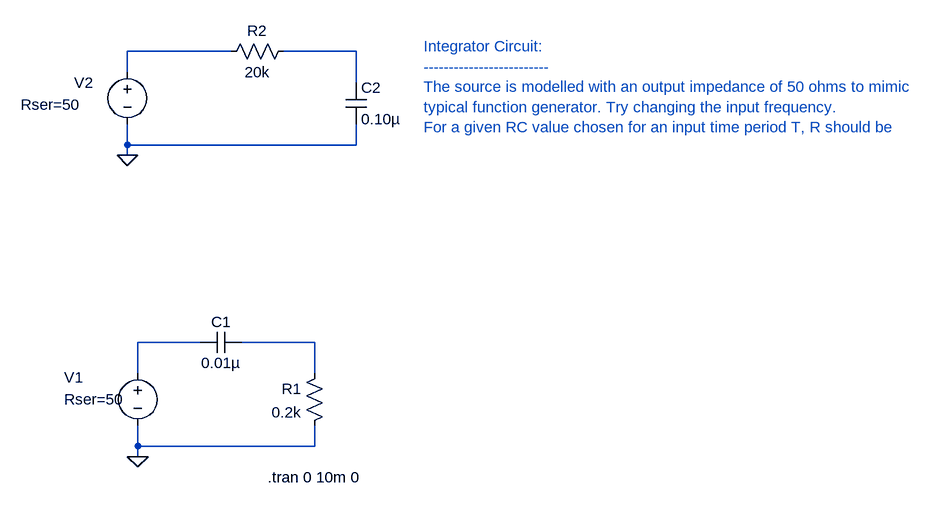
[diagram p0: schematic Demo_RC-Circuits.asc]
Demo_RC-Circuits.asc, the LTspice schematic file:
Version 4.1
SHEET 1 1540 680
WIRE -320 -320 -480 -320
WIRE -128 -320 -240 -320
WIRE -480 -288 -480 -320
WIRE -128 -272 -128 -320
WIRE -480 -176 -480 -208
WIRE -128 -176 -128 -208
WIRE -128 -176 -480 -176
WIRE -480 -160 -480 -176
WIRE -368 128 -464 128
WIRE -192 128 -304 128
WIRE -464 176 -464 128
WIRE -192 176 -192 128
WIRE -464 288 -464 256
WIRE -192 288 -192 256
WIRE -192 288 -464 288
WIRE -464 304 -464 288
FLAG -464 304 0
FLAG -480 -160 0
SYMBOL res -176 160 M0
SYMATTR InstName R1
SYMATTR Value 0.2k
SYMBOL cap -304 112 R90
WINDOW 0 0 32 VBottom 2
WINDOW 3 32 32 VTop 2
SYMATTR InstName C1
SYMATTR Value 0.01µ
SYMBOL voltage -464 160 R0
WINDOW 0 -113 22 Left 2
WINDOW 3 -163 99 Invisible 2
WINDOW 123 0 0 Left 0
WINDOW 39 -113 56 Left 2
SYMATTR InstName V1
SYMATTR Value PULSE(5 -5 0 10n 10n 0.1m 0.2m)
SYMATTR SpiceLine Rser=50
SYMBOL cap -144 -272 R0
SYMATTR InstName C2
SYMATTR Value 0.10µ
SYMBOL res -336 -304 R270
WINDOW 0 32 56 VTop 2
WINDOW 3 0 56 VBottom 2
SYMATTR InstName R2
SYMATTR Value 20k
SYMBOL voltage -480 -304 R0
WINDOW 123 0 0 Left 0
WINDOW 39 -164 66 Left 2
WINDOW 0 -82 32 Left 2
WINDOW 3 -165 103 Invisible 2
SYMATTR SpiceLine Rser=50
SYMATTR InstName V2
SYMATTR Value PULSE(-5 5 0 10n 10n 25u 50u)
TEXT -264 336 Left 2 !.tran 0 10m 0
TEXT -24 -328 Left 2 ;Integrator Circuit:\n-------------------------\nThe source is modelled with an output impedance of 50 ohms to mimic\ntypical function generator. Try changing the input frequency.\nFor a given RC value chosen for an input time period T, R should be

The netlist it stands for:
* Demo_RC-Circuits.asc
R1 N004 0 0.2k
C1 N004 N003 0.01µ
V1 N003 0 PULSE(5 -5 0 10n 10n 0.1m 0.2m) Rser=50
C2 N002 0 0.10µ
R2 N001 N002 20k
V2 N001 0 PULSE(-5 5 0 10n 10n 25u 50u) Rser=50
.tran 0 10m 0
* Integrator Circuit:
* -------------------------
* The source is modelled with an output impedance of 50 ohms to mimic
* typical function generator. Try changing the input frequency.
* For a given RC value chosen for an input time period T, R should be
.backanno
.end